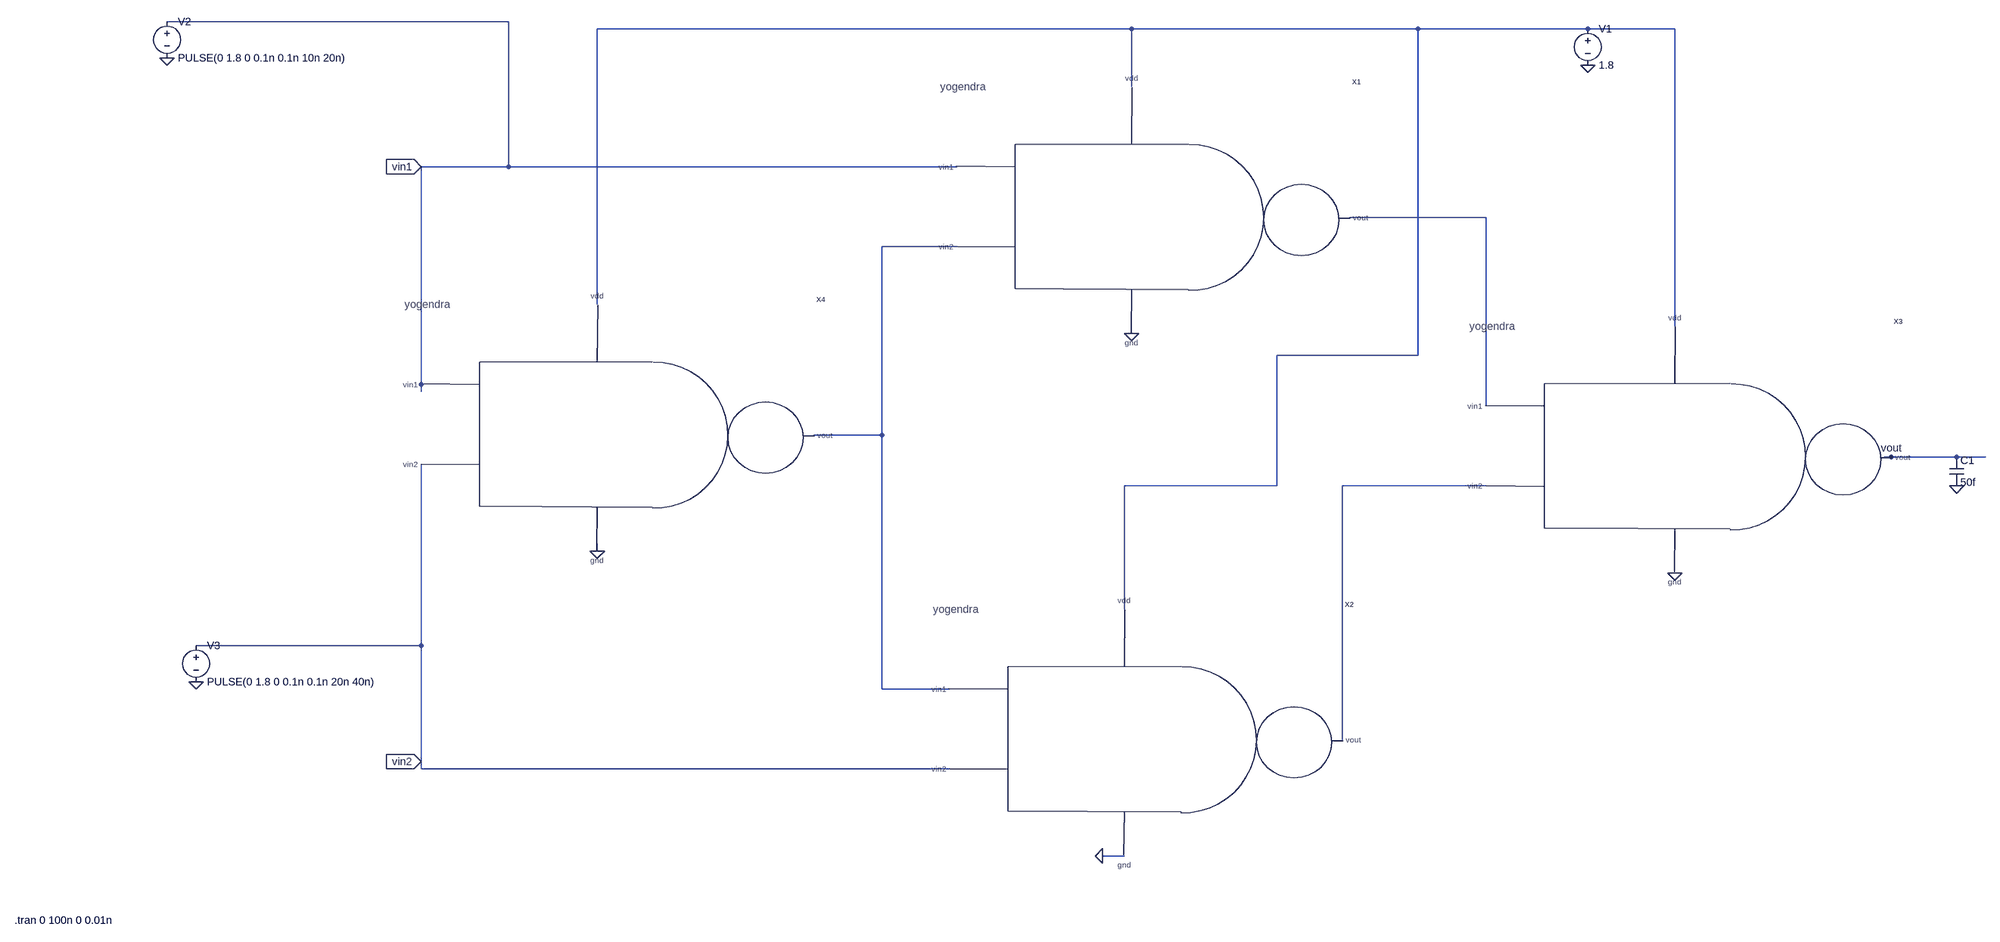
[diagram p0: schematic xor_using_nand.asc]
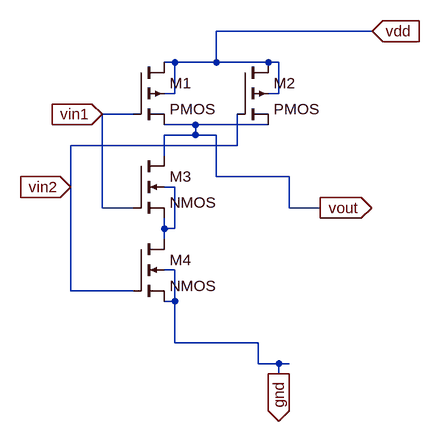
[diagram p1: sub-circuit nandd.asc]
xor_using_nand.asc, the LTspice schematic file:
Version 4.1
SHEET 1 2500 1720
WIRE -1680 -480 -2432 -480
WIRE 256 -464 -1456 -464
WIRE 1072 -464 256 -464
WIRE 1616 -464 1072 -464
WIRE 1808 -464 1616 -464
WIRE 256 -336 256 -464
WIRE -1680 -160 -1680 -480
WIRE -1680 -160 -1872 -160
WIRE -160 -160 -1680 -160
WIRE 1392 -48 736 -48
WIRE -160 16 -464 16
WIRE -1456 144 -1456 -464
WIRE 1808 192 1808 -464
WIRE 1072 256 1072 -464
WIRE 1072 256 576 256
WIRE -1872 320 -1872 -160
WIRE -1872 336 -1872 320
WIRE 1392 368 1392 -48
WIRE -464 432 -464 16
WIRE -464 432 -976 432
WIRE 2288 480 2272 480
WIRE 2432 480 2288 480
WIRE 2496 480 2432 480
WIRE 576 544 576 256
WIRE 576 544 240 544
WIRE 1392 544 720 544
WIRE -1456 688 -1456 672
WIRE 240 816 240 544
WIRE -1872 896 -1872 496
WIRE -1872 896 -2368 896
WIRE -464 992 -464 432
WIRE -176 992 -464 992
WIRE 720 1104 720 544
WIRE -1872 1152 -1872 896
WIRE -1872 1168 -1872 1152
WIRE -176 1168 -1872 1168
WIRE 240 1360 192 1360
FLAG -1872 -160 vin1
IOPIN -1872 -160 In
FLAG -1872 1152 vin2
IOPIN -1872 1152 In
FLAG 2288 480 vout
FLAG 1808 736 0
FLAG 1616 -384 0
FLAG 192 1360 0
FLAG 256 208 0
FLAG -1456 688 0
FLAG -2368 976 0
FLAG -2432 -400 0
FLAG 2432 544 0
SYMBOL nandd 160 -48 R0
SYMATTR InstName X1
SYMBOL nandd 144 1104 R0
SYMATTR InstName X2
SYMBOL nandd 1712 480 R0
SYMATTR InstName X3
SYMBOL nandd -1552 432 R0
SYMATTR InstName X4
SYMBOL voltage 1616 -480 R0
WINDOW 123 0 0 Left 0
WINDOW 39 0 0 Left 0
SYMATTR InstName V1
SYMATTR Value 1.8
SYMBOL voltage -2432 -496 R0
WINDOW 123 0 0 Left 0
WINDOW 39 0 0 Left 0
SYMATTR InstName V2
SYMATTR Value PULSE(0 1.8 0 0.1n 0.1n 10n 20n)
SYMBOL voltage -2368 880 R0
WINDOW 123 0 0 Left 0
WINDOW 39 0 0 Left 0
SYMATTR InstName V3
SYMATTR Value PULSE(0 1.8 0 0.1n 0.1n 20n 40n)
SYMBOL cap 2416 480 R0
SYMATTR InstName C1
SYMATTR Value 50f
TEXT -2768 1704 Left 2 !.tran 0 100n 0 0.01n

nandd.asc, the sub-circuit schematic file:
Version 4.1
SHEET 1 880 680
WIRE 544 0 304 0
WIRE 240 48 224 48
WIRE 304 48 304 0
WIRE 304 48 240 48
WIRE 384 48 304 48
WIRE 400 48 384 48
WIRE 240 96 240 48
WIRE 240 96 224 96
WIRE 400 96 400 48
WIRE 400 96 384 96
WIRE 176 128 128 128
WIRE 272 144 224 144
WIRE 384 144 272 144
WIRE 272 160 272 144
WIRE 272 160 224 160
WIRE 304 160 272 160
WIRE 336 176 336 128
WIRE 336 176 80 176
WIRE 224 192 224 160
WIRE 304 224 304 160
WIRE 416 224 304 224
WIRE 80 240 80 176
WIRE 240 240 224 240
WIRE 128 272 128 128
WIRE 176 272 128 272
WIRE 416 272 416 224
WIRE 464 272 416 272
WIRE 224 304 224 288
WIRE 240 304 240 240
WIRE 240 304 224 304
WIRE 224 320 224 304
WIRE 240 368 224 368
WIRE 80 400 80 240
WIRE 176 400 80 400
WIRE 240 416 240 368
WIRE 240 416 224 416
WIRE 240 480 240 416
WIRE 368 480 240 480
WIRE 368 512 368 480
WIRE 400 512 368 512
WIRE 416 512 400 512
WIRE 400 528 400 512
FLAG 464 272 vout
IOPIN 464 272 Out
FLAG 128 128 vin1
IOPIN 128 128 In
FLAG 80 240 vin2
IOPIN 80 240 In
FLAG 544 0 vdd
IOPIN 544 0 In
FLAG 400 528 gnd
IOPIN 400 528 Out
SYMBOL pmos4 176 48 R0
SYMATTR InstName M1
SYMATTR Value2 l=180n w=810n
SYMBOL pmos4 336 48 R0
SYMATTR InstName M2
SYMATTR Value2 l=180n w=810n
SYMBOL nmos4 176 192 R0
SYMATTR InstName M3
SYMATTR Value2 l=180n w=270n
SYMBOL nmos4 176 320 R0
SYMATTR InstName M4
SYMATTR Value2 l=180n w=270n

The netlist it stands for:
* xor_using_nand.asc
X§X1 vin1 N003 N001 0 N002 nandd
X§X2 N003 vin2 N001 0 N004 nandd
X§X3 N002 N004 N001 0 vout nandd
X§X4 vin1 vin2 N001 0 N003 nandd
V1 N001 0 1.8
V2 vin1 0 PULSE(0 1.8 0 0.1n 0.1n 10n 20n)
V3 vin2 0 PULSE(0 1.8 0 0.1n 0.1n 20n 40n)
C1 vout 0 50f

* block symbol definitions
.subckt nandd vin1 vin2 vdd gnd vout
M1 vdd vin1 vout vdd PMOS l=180n w=810n
M2 vdd vin2 vout vdd PMOS l=180n w=810n
M3 vout vin1 N001 N001 NMOS l=180n w=270n
M4 N001 vin2 gnd gnd NMOS l=180n w=270n
.ends nandd

.model NMOS NMOS
.model PMOS PMOS
.lib standard.mos
.tran 0 100n 0 0.01n
.backanno
.end